# Altium project PulseAmplifier.PrjPcb
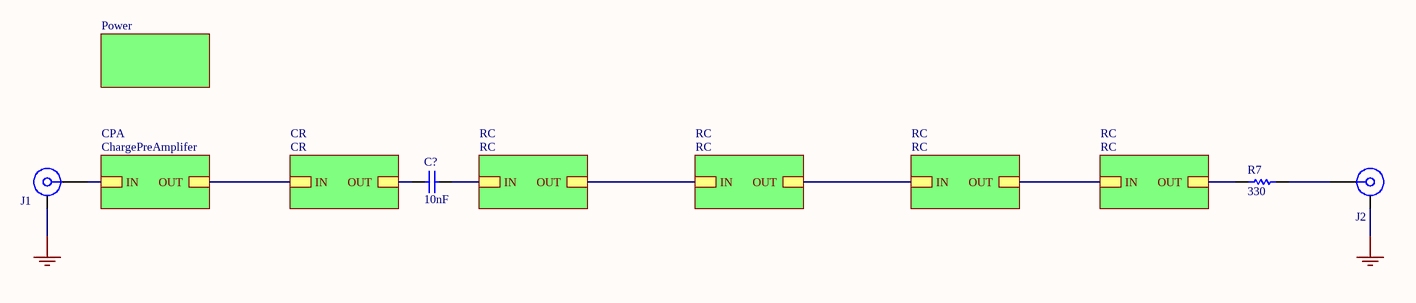
[diagram p0: pulseAmplifier.SchDoc]
5 sheets, 92 parts. Net scope: hierarchical (ports join the sheet entries above them; power ports are global).
Board file: PulseAmplifier.PcbDoc
Sheets:
  pulseAmplifier.SchDoc
     = Power.SchDoc
    CPA = ChargePreAmplifer.SchDoc
    CR = CR.SchDoc
    RC = RC.SchDoc
    RC = RC.SchDoc
    RC = RC.SchDoc
    RC = RC.SchDoc

## Sheet pulseAmplifier.SchDoc
size A4

### Parts
C?  10nF  [CAPC0603(1608)100_N]
J1  32K145-400L5  [ROS-32K145-400L5_V]  (value not drawn)
J2  32K145-400L5  [ROS-32K145-400L5_V]  (value not drawn)
R7  330  [RESC0603(1608)_N]

### Sub-sheets
CPA = ChargePreAmplifer: IN, OUT
CR = CR: IN, OUT
RC = RC: IN, OUT
RC = RC: IN, OUT
RC = RC: IN, OUT
RC = RC: IN, OUT
? = Power: no entries

### Nets
GND: J1.MP J2.MP
NetC8_2: sheet CPA/OUT, sheet CR/IN
NetC?_1: C?.1 ; sheet RC/IN
NetC?_2: C?.2 ; sheet CR/OUT
NetJ1_1: J1.1 ; sheet CPA/IN
NetJ2_1: J2.1 R7.2
NetR7_1: R7.1 ; sheet RC/OUT
NetR8_RC1_2: sheet RC/OUT, sheet RC/IN
NetR8_RC2_2: sheet RC/OUT, sheet RC/IN
NetR8_RC3_2: sheet RC/OUT, sheet RC/IN

### Library data of the parts
C? = CMP-1035-02589-1: 10nF Film; Value: 100nF; Case-EIA: 0603; Rated Voltage: 25 V; Tolerance: Â±20%; Case-Metric: 1608; Max Thickness: 1 mm; Technology: SMT
J1 J2 = CMP-0751-00004-2: SMA Right Angle Jack, Edge Mount, Up to 18 GHz, -55 to 155 degC; Manufacturer: Rosenberger; Desgin Note 2: For more information about DRC setting, please look at following webpage, http://techdocs.altium.com/display/SCRT/Design+Rule+for+Edge-Mount+Connectors; Design Note 1: Footprint in library is a generic example - only application specific footprint delivers High Performance; ComponentLink5Description: Webshop / RFQ; ComponentLink5URL: http://www.rosenberger.com/en/contact/sales/; ComponentLink3URL: http://rosenberger.de/ok/images/documents/db/32K145-400L5.pdf; DatasheetVersion: b00; ComponentLink2URL: http://rosenberger.de/ok/images/documents/db/32K145-400L5.pdf; ComponentLink4Description: Series Overview / Design Note; ComponentLink1Description: Manufacturer URL; PackageReference: 32K145-400L5; ComponentLink2Description: Datasheet; PartNumber: 32K145-400L5; PackageVersion: b00; PackageDescription: SMA Right Angle Jack, Edge Mount, 14.25 x 9.5 x 4.46 mm; ComponentLink3Description: Package Specification; ComponentLink1URL: http://www.rosenberger.de; ComponentLink4URL: http://rosenberger.de/ok/images/documents/spez/32.pdf; Mounting Technology: Surface Mount
R7 = CMP-1012-00397-1: 100R 0.1W 1% 0603 (1608 Metric)  SMD; Value: 100.00 Ohm; Case-EIA: 0603; Case-Metric: 1608; Technology: SMT; Tolerance: 1 %; Power: 0.1 W

## Sheet Power.SchDoc
size A4
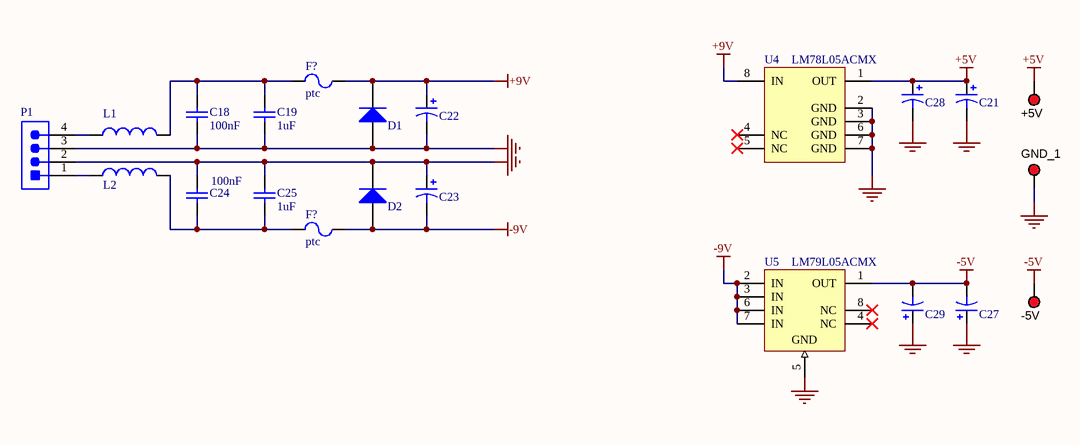
[diagram p1: Power.SchDoc]

### Parts
(Parts that share a designator on the sheet are numbered #1, #2 ... from top to bottom, then left to right.)
+5V  5010  [KSTN-5010_V]  (value not drawn)
-5V  5010  [KSTN-5010_V]  (value not drawn)
C18  100nF  [CAPC0603(1608)100_N]
C19  1uF  [CAPC0603(1608)100_N]
C21  ECA-1HM470  [PNSC-ECA-1HM470]  (value not drawn)
C22  ECA-1HM470  [PNSC-ECA-1HM470]  (value not drawn)
C23  ECA-1HM470  [PNSC-ECA-1HM470]  (value not drawn)
C24  100nF  [CAPC0603(1608)100_N]
C25  1uF  [CAPC0603(1608)100_N]
C27  ECA-1HM470  [PNSC-ECA-1HM470]  (value not drawn)
C28  ECA-1HM470  [PNSC-ECA-1HM470]  (value not drawn)
C29  ECA-1HM470  [PNSC-ECA-1HM470]  (value not drawn)
D1  MMSD4148T3G  [ONSC-SOD123-2-425G-04_V]  (value not drawn)
D2  MMSD4148T3G  [ONSC-SOD123-2-425G-04_V]  (value not drawn)
F?#1  ptc  [LFUS-1206L012WR_V]
F?#2  ptc  [LFUS-1206L012WR_V]
GND_1  5010  [KSTN-5010_V]  (value not drawn)
L1  FBMJ2125HM210NT  [INDC2013X105X50ML20T30]  (value not drawn)
L2  FBMJ2125HM210NT  [INDC2013X105X50ML20T30]  (value not drawn)
P1  22-27-2041  [MOLX-22-27-2041_V]  (value not drawn)
U4  LM78L05ACMX  [M08A_L]
U5  LM79L05ACMX  [D0008A_M]

### Nets
+5V: +5V.1 C21.1(+) C28.1(+) U4.1(OUT)
+9V: C22.1(+) D1.1(CATHODE) F?#1.2 U4.8(IN)
-5V: -5V.1 C27.2(-) C29.2(-) U5.1(OUT)
-9V: C23.2(-) D2.2(ANODE) F?#2.2 U5.2(IN) U5.3(IN) U5.6(IN) U5.7(IN)
GND: C18.1 C19.1 C21.2(-) C22.2(-) C23.1(+) C24.2 C25.2 C27.1(+) C28.2(-) C29.1(+) D1.2(ANODE) D2.1(CATHODE) GND_1.1 P1.2 P1.3 U4.2(GND) U4.3(GND) U4.6(GND) U4.7(GND) U5.5(GND)
NetC18_2: C18.2 C19.2 F?#1.1 L1.2
NetC24_1: C24.1 C25.1 F?#2.1 L2.2
NetL1_1: L1.1 P1.4
NetL2_1: L2.1 P1.1

Not connected (* = marked no-connect by the designer): U4 4(NC)* 5(NC)*; U5 4(NC)* 8(NC)*

### Library data of the parts
+5V -5V GND_1 = CMP-1672-00002-3: Test Point, Red, Through Hole, RoHS, Bulk; REACH SVHC: No SVHC; Contact Material: Bronze; PackageDescription: 1-Pin Through Hole Device, Dia 3.17 mm; Mounting Technology: Through Hole; Colour: Red; PackageReference: 5010; Height: 8.12 mm; Pins: 1; RoHSCompliant: true; Package Quantity: 100; Packaging: Bulk; Mount: Through Hole; DatasheetVersion: Rev. F, 12/2013; Contact Plating: Silver
C18 C24 = CMP-1035-02589-1: CAP 100nF 25V ±20% 0603 (1608 Metric) Thickness 1mm SMD; Case-EIA: 0603; Tolerance: Â±20%; Case-Metric: 1608; Value: 100nF; Max Thickness: 1 mm; Technology: SMT; Rated Voltage: 25 V
C19 C25 = CMP-1035-02589-1: CAP 1uF 25V ±20% 0603 (1608 Metric) Thickness 1mm SMD; Value: 100nF; Case-EIA: 0603; Tolerance: Â±20%; Case-Metric: 1608; Max Thickness: 1 mm; Technology: SMT; Rated Voltage: 25 V
C21-C23 C27-C29 = CMP-1665-00013-1: CAP ALUM 47UF 50V 20% RADIAL; PartNumber: ECA-1HM470; PackageReference: ECA-1HM470; ComponentLink1Description: Datasheet; ComponentLink1URL: http://industrial.panasonic.com/cdbs/www-data/pdf/RDF0000/ABA0000C1047.pdf
D1 D2 = CMP-0895-00002-1: Switching Diode, 100 V, 200 mA, -55 to 150 degC, 2-Pin SOD123 (425), RoHS, Tape and Reel; Manufacturer: ON Semiconductor; CD (Max): 4 pF; IR @ VR: 75 V (Max)=50 uA; PD (Max): 425 mW; VF (Max): 1 A; Trr (Max): 4 ns; VBR (Min): 100 V; ComponentLink1URL: http://www.onsemi.com/; ComponentLink1Description: Manufacturer URL; PackageReference: SOD123-2-425G-04; PackageDescription: 2-Pin SOD123, Body 2.69 x 1.6 mm, Height 1.35 mm; ComponentLink2Description: Datasheet; Mounting Technology: Surface Mount; RoHS: TRUE; PartNumber: MMSD4148T3G; PackageVersion: Rev. 04G; DatasheetVersion: Rev. 11; Temperature Range: -55 to 150 degC; ComponentLink3Description: Package Specification; Packing: Tape and Reel; ComponentLink3URL: http://www.onsemi.com/pub_link/Collateral/425-04.PDF; ComponentLink2URL: http://www.onsemi.com/pub_link/Collateral/MMSD4148T1-D.PDF
F?#1 F?#2 = CMP-2000-05470-1: 200mA PTC; Manufacturer: Littelfuse; Hold Current [Ih]: 0.125A; Working Voltage-Max: 30V; Trip Current: 0.29A; Operating Temp Range: -40to+85°C; Package Reference: 1206; Package Description: 2-Pin Surface Mount Device, Body 3.2 x 1.65 mm; Mounting Technology: SurfaceMount; Manufacturer URL: http://www.littelfuse.com/; Datasheet URL: https://datasheet.ciiva.com/26787/1206l012wr-26787215.pdf; Size: 1206; Datasheet Version: 04/2012
L1 L2 = CMP-1660-00003-1: Chip Inductor, 21 Ohm, +/- 30%, 6 A, -40 to 125 degC, 0805 (2012 Metric), RoHS, Tape and Reel; Core Material: Ferrite; Current Rating: 6 A; Resistance: 4 mohm; Case\Package: 0805; Impedance: 21 Ohm; Min Operating Temperature: -40 degC; Width: 1.25 mm; PackageDescription: 2-Pin Surface Mount Device, Body 2 x 1.25 mm; Mounting Technology: Surface Mount; Package Quantity: 1; DatasheetVersion: 08/2016; Tolerance: 30%; Mount: Surface Mount; Max Operating Temperature: 125 degC; Height: 0.85 mm; ComponentLink1URL: http://www.t-yuden.com/; Case Code (Metric): 2012; ComponentLink1Description: Manufacturer URL; ComponentLink2URL: http://ds.yuden.co.jp/TYCOMPAS/ut/detail.do?productNo=FBMJ2125HM210NT&fileName=FBMJ2125HM210NT_SS&mode=specSheetDownload; Case Code (Imperial): 0805; Packaging: Tape and Reel; ComponentLink2Description: Datasheet; PackageReference: 0805; RoHSCompliant: true; Max Current Rating: 6 A; Length: 2 mm; REACH SVHC: Unknown
P1 = CMP-2000-05243-1: Male Header, Pitch 2.54 mm, 1 x 4 Position, Height 11.7 mm, Tail Length 3.56 mm, RoHS, Bulk; Manufacturer: Molex; Voltage rating: 250V; Current rating: 4A; Datasheet Version: Rev. F, 06/2009; Operating temperature: 0degCto+75degC; Contact material: Tinplatedbrass; Manufacturer URL: http://www.molex.com/; Housing material: Nylon(UL94V-0); Datasheet URL: http://www.molex.com/pdm_docs/sd/022272041_sd.pdf
U4 = CMP-0062-01154-2: 3-Terminal Positive Regulators, 8-pin Narrow SOIC; Manufacturer: National Semiconductor; PackageTopMarking: NSZXTT*LM78L*05ACM; PowerWise: N; CompType: LDO IC; Code_JEDEC: MS-012-AA; PackageVersion: revM, May-2009; PackageDescription: SOIC Narrow, 4.9 x 3.9 x 1.45mm, 8 Lead, 1.27mm Pitch; ComponentLink2Description: LM78L05 Web Page; ComponentLink2URL: http://www.national.com/pf/LM/LM78L05.html; ComponentLink3Description: M08A Package Page; RevisionNote: Component URLs added; ComponentLink3URL: http://www.national.com/packaging/folders/m08a.html; ComponentLink1URL: http://www.national.com/ds/LM/LM78L05.pdf; ComponentLink1Description: LM78L05 Datasheet; PinCount: 8; DatasheetVersion: Apr-2006; Code_IPC: SOIC127P600-8; RoHS: N; PackageReference: M08A
U5 = CMP-0062-01120-3: Series 3-Terminal Negative Regulators, 8-pin Narrow SOIC; Manufacturer: Texas Instruments; CompType: LDO IC; PackageTopMarking: NSZXTT*LM79L*05ACM; PowerWise: N; PackageReference: D0008A; Code_JEDEC: MS-012-AA; PackageDescription: SOIC Narrow, 4.9 x 3.9 x 1.45mm, 8 Lead, 1.27mm Pitch; PinCount: 8; RoHS: N; Code_IPC: SOIC127P600-8; ComponentLink1Description: Datasheet URL; ComponentLink1URL: http://www.ti.com/general/docs/lit/getliterature.tsp?genericPartNumber=LM79L05&fileType=pdf

## Sheet ChargePreAmplifer.SchDoc
size A4
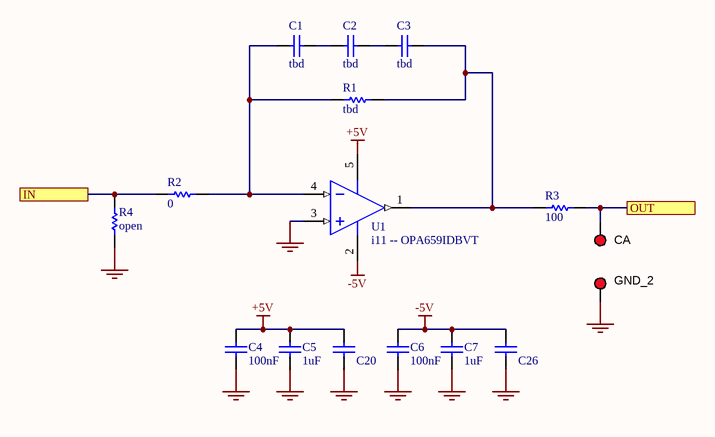
[diagram p2: ChargePreAmplifer.SchDoc]

### Parts
C1  tbd  [CAPC0603(1608)100_N]
C2  tbd  [CAPC0603(1608)100_N]
C3  tbd  [CAPC0603(1608)100_N]
C4  100nF  [CAPC0603(1608)100_N]
C5  1uF  [CAPC0603(1608)100_N]
C6  100nF  [CAPC0603(1608)100_N]
C7  1uF  [CAPC0603(1608)100_N]
C20  10uF X7R 10V 0805  [CAPC0805(2012)145_N]  (value not drawn)
C26  10uF X7R 10V 0805  [CAPC0805(2012)145_N]  (value not drawn)
CA  5010  [KSTN-5010_V]  (value not drawn)
GND_2  5010  [KSTN-5010_V]  (value not drawn)
R1  tbd  [RESC0603(1608)_N]
R2  0  [RESC0603(1608)_N]
R3  100  [RESC0603(1608)_L]
R4  open  [RESC0603(1608)_N]
U1  i11 -- OPA659IDBVT  [TI-DBV5_L]

### Ports
IN, OUT

### Nets
+5V: C4.2 C5.2 C20.2 U1.5(VS+)
-5V: C6.2 C7.2 C26.2 U1.2(VS-)
GND: C4.1 C5.1 C6.1 C7.1 C20.1 C26.1 GND_2.1 R4.1 U1.3(IN+)
NetC1_1: C1.1 C2.2
NetC1_2: C1.2 R1.1 R2.2 U1.4(IN-)
NetC2_1: C2.1 C3.2
NetC3_1: C3.1 R1.2 R3.1 U1.1(OUT)
NetC8_2: CA.1 R3.2 ; port OUT
NetJ1_1: R2.1 R4.2 ; port IN

### Library data of the parts
C1-C3 C5 C7 = CMP-1035-02589-1: as C19 on sheet Power; Max Thickness: 1 mm; Technology: SMT; Rated Voltage: 25 V
C4 C6 = CMP-1035-02589-1: as C18 on sheet Power; Value: 100nF; Max Thickness: 1 mm; Technology: SMT; Rated Voltage: 25 V
C20 C26 = CMP-1036-04932-1: Case-EIA: 0805; Case-Metric: 2012; Rated Voltage: 25 V; Tolerance: Â±10%; Technology: SMT; Value: 10uF; Max Thickness: 1.45 mm
CA GND_2 = CMP-1672-00002-3: as +5V on sheet Power; REACH SVHC: No SVHC; Contact Material: Bronze; PackageDescription: 1-Pin Through Hole Device, Dia 3.17 mm; Mounting Technology: Through Hole; Colour: Red; PackageReference: 5010; Height: 8.12 mm; Pins: 1; RoHSCompliant: true; Package Quantity: 100; Packaging: Bulk; Mount: Through Hole; DatasheetVersion: Rev. F, 12/2013; Contact Plating: Silver
R1-R4 = CMP-1012-00397-1: as R7 on sheet pulseAmplifier; Technology: SMT; Tolerance: 1 %; Power: 0.1 W
U1 = CMP-0018-00409-1: 650 MHz Unity Gain Stable JFET Input Amplifier, 7 to 13 V, -40 to 85 degC, 5-pin SOT23 (DBV5), Green (RoHS & no Sb/Br); Manufacturer: Texas Instruments; Number of Channels: 1; THD (Fc is 1 MHz)(Typ)(dB): -78; BW @ Acl(MHz): 650; Slew Rate(Typ)(V/us): 2550; Vs(Max)(V): 13; 3rd Harmonic(dBc): 100; Sub Family: High Output Current Amplifier (>=50mA), High Speed Amplifier (>=50MHz); Vn at Flatband(Typ)(nV/rtHz): 8.9; 2nd Harmonic(dBc): 79; Vio(Max)(mV): 5; Vs(Min)(V): 7; Acl, min stable gain(V/V): 2; Io(Typ)(mA): 70; @ MHz: 10; Iq per channel(Max)(mA): 33.5; Iib(Max)(nA): 1.2; Code_JEDEC: MO-178; ComponentLink1Description: Manufacturer URL; ComponentLink3Description: Package Specification; PackageReference: DBV5; PackageVersion: 4073253-4/K, 03/2006; ComponentLink3URL: http://www.ti.com/litv/pdf/mpds018i; ComponentLink2Description: Datasheet; Mounting Technology: Surface Mount; PackageDescription: 5-Pin Plastic Small Outline, Body 1.6 x 2.9 mm, Pitch 0.95 mm; PartNumber: OPA659IDBVT; DatasheetVersion: SBOS342B; ComponentLink1URL: http://www.ti.com/; Eco-Plan: Green (RoHS & no Sb/Br); ComponentLink2URL: http://www.ti.com/general/docs/lit/getliterature.tsp?genericPartNumber=OPA659&fileType=pdf

## Sheet CR.SchDoc
size A4
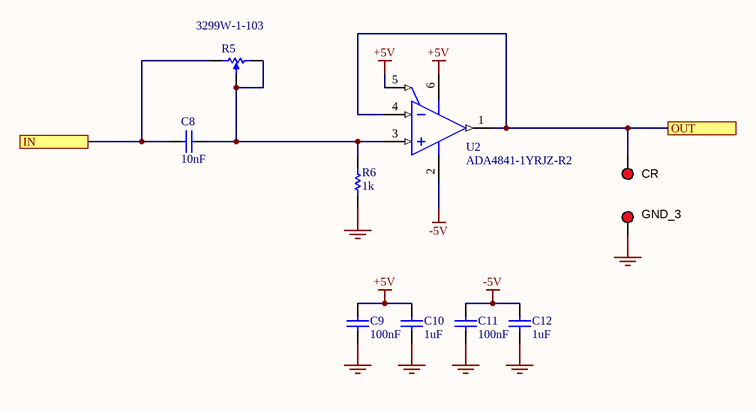
[diagram p3: CR.SchDoc]

### Parts
C8  10nF  [CAPC0603(1608)100_N]
C9  100nF  [CAPC0603(1608)100_N]
C10  1uF  [CAPC0603(1608)100_N]
C11  100nF  [CAPC0603(1608)100_N]
C12  1uF  [CAPC0603(1608)100_N]
CR  5010  [KSTN-5010_V]  (value not drawn)
GND_3  5010  [KSTN-5010_V]  (value not drawn)
R5  3299W-1-103  [BOUR-3299W-3_V]
R6  1k  [RESC0603(1608)_N]
U2  ADA4841-1YRJZ-R2  [ADI-RJ-6_M]

### Ports
IN, OUT

### Nets
+5V: C9.2 C10.2 U2.5(~{POWER_DOWN}) U2.6(+VS)
-5V: C11.2 C12.2 U2.2(-VS)
GND: C9.1 C10.1 C11.1 C12.1 GND_3.1 R6.1
NetC8_1: C8.1 R5.2 R5.3 R6.2 U2.3(+IN)
NetC8_2: C8.2 R5.1 ; port IN
NetC?_2: CR.1 U2.1(VOUT) U2.4(-IN) ; port OUT

### Library data of the parts
C8 = CMP-1035-02589-1: as C? on sheet pulseAmplifier; Max Thickness: 1 mm; Technology: SMT
C9 C11 = CMP-1035-02589-1: as C18 on sheet Power; Value: 100nF; Max Thickness: 1 mm; Technology: SMT; Rated Voltage: 25 V
C10 C12 = CMP-1035-02589-1: as C19 on sheet Power; Max Thickness: 1 mm; Technology: SMT; Rated Voltage: 25 V
CR GND_3 = CMP-1672-00002-3: as +5V on sheet Power; REACH SVHC: No SVHC; Contact Material: Bronze; PackageDescription: 1-Pin Through Hole Device, Dia 3.17 mm; Mounting Technology: Through Hole; Colour: Red; PackageReference: 5010; Height: 8.12 mm; Pins: 1; RoHSCompliant: true; Package Quantity: 100; Packaging: Bulk; Mount: Through Hole; DatasheetVersion: Rev. F, 12/2013; Contact Plating: Silver
R5 = CMP-2000-05584-1: Square Trimpot(R) Trimming Potentiometer, 10 KOhm, +/- 10%, 500 mW, -55 to 125 degC, 3-Pin THD, RoHS, Tube; Element Type: Cermet; Unit Weight: 0.035000oz; Brand: Bourns; Power Rating: 500mW(1/2W); Resistance: 10kOhms; Qualification: Commercial; Adjustment: TopCrossed; Datasheet Version: 04/2014; Product Category: TrimmerResistors-ThroughHole; Mounting Technology: ThroughHole; Manufacturer URL: http://www.bourns.com/; Package Description: 3-Pin Surface Mount Device, Body 9.53 x 6.1 mm, Pitch 2.54 mm; Product: Multiturn; Length: 10.03mm; Termination Style: Pin; Tradename: Trimpot; Type: Trimmers; Manufacturer: Bourns; Width: 9.53mm; Mounting: PanelMount; RoHS: No / RoHSVersionAvailable; Taper: Linear; Datasheet URL: http://www.bourns.com/docs/Product-Datasheets/3299.pdf; Product Type: SquareTrimmingPotentiometer; Package Reference: 3299W; Tolerance: 10%; Series: 3299; Operating Temperature Range: -55Cto+125C; Packaging: Tube
R6 = CMP-1012-00397-1: 1k 1% Metal film; Value: 100.00 Ohm; Case-EIA: 0603; Power: 0.1 W; Case-Metric: 1608; Technology: SMT; Tolerance: 1 %
U2 = CMP-0384-01553-2: Single Channel Low Wide Band Noise Operational Amplifier, 80 MHz BW, 13 V/us SR, Industrial, 6-pin SOT23 (RJ-6), Reel; Manufacturer: Analog Devices; Slew Rate: 13V/us; Small Signal Bandwidth: 80MHz; Input Offset Voltage: 40uV; V Span Min: 2.7V; Iq/Amp: 1.5mA; V Span Max: 12V; Amplifiers Per Package: 1; Input Bias Current: 3uA; ComponentLink2URL: http://www.analog.com/static/imported-files/data_sheets/ADA4841-1_4841-2.pdf; Code_JEDEC: MO-178-AB; PartNumber: ADA4841-1YRJZ-R2; ComponentLink1URL: http://www.analog.com/en/index.html; ComponentLink2Description: Datasheet; ComponentLink3Description: Package Specification; ComponentLink4Description: Reference Circuit; Mounting Technology: Surface Mount; RevisionNote: Reference Circuit URL fixed; PackageReference: RJ-6; ComponentLink4URL: http://www.analog.com/en/all-operational-amplifiers-op-amps/operational-amplifiers-op-amps/ada4841-1/products/product.html#product-recommendations; PackageDescription: 6-Pin Small Outline Transistor Package, Body 2.9 x 1.6 mm, Pitch 0.95 mm; ComponentLink1Description: Manufacturer URL; DatasheetVersion: Rev. E; PackageVersion: 121608-A; ComponentLink3URL: http://www.analog.com/static/imported-files/packages/PKG_PDF/SOT-23(RJ)/RJ_6.pdf; Generic Part Number: ADA4841-1

## Sheet RC.SchDoc
size A4
Used 4 times, as channels RC, RC, RC, RC. Parts and nets are listed once, with the designators drawn on the sheet.
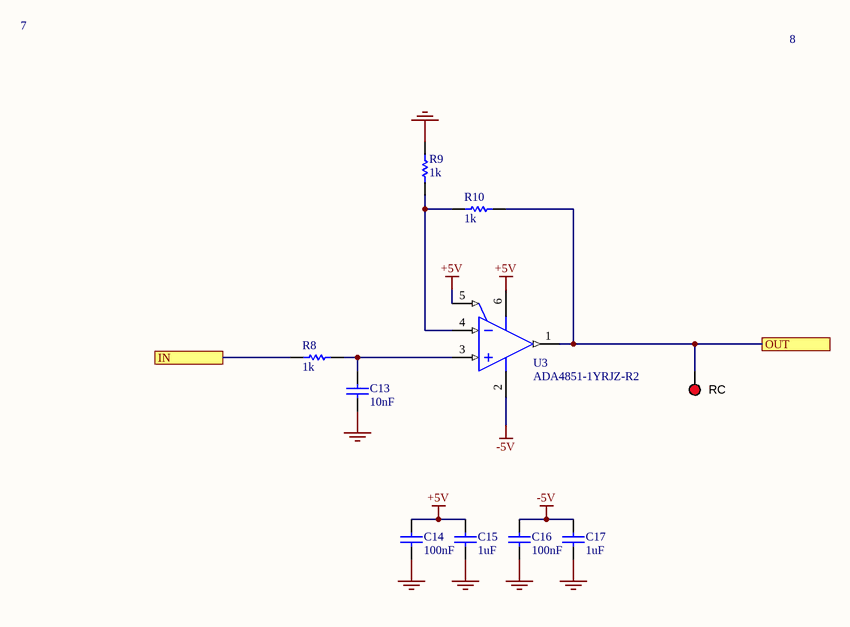
[diagram p4: RC.SchDoc]

### Parts
C13  10nF  [CAPC0603(1608)100_N]
C14  100nF  [CAPC0603(1608)100_N]
C15  1uF  [CAPC0603(1608)100_N]
C16  100nF  [CAPC0603(1608)100_N]
C17  1uF  [CAPC0603(1608)100_N]
R8  1k  [RESC0603(1608)_N]
R9  1k  [RESC0603(1608)_N]
R10  1k  [RESC0603(1608)_N]
RC  5010  [KSTN-5010_V]  (value not drawn)
U3  ADA4851-1YRJZ-R2  [ADI-RJ-6_N]

### Ports
IN, OUT

### Nets
+5V: C14.2 C15.2 U3.5(~{POWER_DOWN}) U3.6(+VS)
-5V: C16.2 C17.2 U3.2(-VS)
GND: C13.2 C14.1 C15.1 C16.1 C17.1 R9.1
IN: R8.2 ; port IN
OUT: R10.1 RC.1 U3.1(VOUT) ; port OUT
NetC13_1: C13.1 R8.1 U3.3(+IN)
NetR9_2: R9.2 R10.2 U3.4(-IN)

### Channels
RC: designators end in _RC4; ports IN=NetC?_1 OUT=NetR8_RC3_2
RC: designators end in _RC3; ports IN=NetR8_RC3_2 OUT=NetR8_RC2_2
RC: designators end in _RC2; ports IN=NetR8_RC2_2 OUT=NetR8_RC1_2
RC: designators end in _RC1; ports IN=NetR8_RC1_2 OUT=NetR7_1

### Notes on the sheet
- 7
- 8

### Library data of the parts
C13 = CMP-1035-02589-1: as C? on sheet pulseAmplifier; Max Thickness: 1 mm; Technology: SMT
C14 C16 = CMP-1035-02589-1: as C18 on sheet Power; Value: 100nF; Max Thickness: 1 mm; Technology: SMT; Rated Voltage: 25 V
C15 C17 = CMP-1035-02589-1: as C19 on sheet Power; Max Thickness: 1 mm; Technology: SMT; Rated Voltage: 25 V
R8-R10 = CMP-1012-00397-1: as R6 on sheet CR; Technology: SMT; Tolerance: 1 %
RC = CMP-1672-00002-3: as +5V on sheet Power; REACH SVHC: No SVHC; Contact Material: Bronze; PackageDescription: 1-Pin Through Hole Device, Dia 3.17 mm; Mounting Technology: Through Hole; Colour: Red; PackageReference: 5010; Height: 8.12 mm; Pins: 1; RoHSCompliant: true; Package Quantity: 100; Packaging: Bulk; Mount: Through Hole; DatasheetVersion: Rev. F, 12/2013; Contact Plating: Silver
U3 = CMP-0384-01563-2: Single Channel Low Power Operational Amplifier, 130 MHz BW, 375 V/us SR, Industrial, 6-pin SOT23 (RJ-6), Reel; Manufacturer: Analog Devices; V Span Max: 12V; Amplifiers Per Package: 1; Iq/Amp: 3.2mA; Small Signal Bandwidth: 130MHz; Automotive Qualified: Yes; Input Offset Voltage: 600uV; Input Bias Current: 2.2uA; V Span Min: 2.7V; DatasheetVersion: Rev. J; PartNumber: ADA4851-1YRJZ-R2; ComponentLink2Description: Datasheet; ComponentLink1URL: http://www.analog.com/en/index.html; ComponentLink3URL: http://www.analog.com/static/imported-files/packages/PKG_PDF/SOT-23(RJ)/RJ_6.pdf; ComponentLink3Description: Package Specification; ComponentLink1Description: Manufacturer URL; Mounting Technology: Surface Mount; Code_JEDEC: MO-178-AB; Generic Part Number: ADA4851-1; PackageReference: RJ-6; RevisionNote: Reference Circuit URL fixed; ComponentLink4URL: http://www.analog.com/en/all-operational-amplifiers-op-amps/operational-amplifiers-op-amps/ada4851-1/products/product.html#product-recommendations; Slew Rate: 375V/us; ComponentLink4Description: Reference Circuit; ComponentLink2URL: http://www.analog.com/static/imported-files/data_sheets/ADA4851-1_4851-2_4851-4.pdf; PackageDescription: 6-Pin Small Outline Transistor Package, Body 2.9 x 1.6 mm, Pitch 0.95 mm; PackageVersion: 121608-A

## Nets that join several sheets
+5V: Power (+5V.1 C21.1 C28.1 U4.1), ChargePreAmplifer (C4.2 C5.2 C20.2 U1.5), CR (C9.2 C10.2 U2.5 U2.6), RC (C14_RC4.2 C15_RC4.2 U3_RC4.5 U3_RC4.6), RC (C14_RC3.2 C15_RC3.2 U3_RC3.5 U3_RC3.6), RC (C14_RC2.2 C15_RC2.2 U3_RC2.5 U3_RC2.6), RC (C14_RC1.2 C15_RC1.2 U3_RC1.5 U3_RC1.6)
-5V: Power (-5V.1 C27.2 C29.2 U5.1), ChargePreAmplifer (C6.2 C7.2 C26.2 U1.2), CR (C11.2 C12.2 U2.2), RC (C16_RC4.2 C17_RC4.2 U3_RC4.2), RC (C16_RC3.2 C17_RC3.2 U3_RC3.2), RC (C16_RC2.2 C17_RC2.2 U3_RC2.2), RC (C16_RC1.2 C17_RC1.2 U3_RC1.2)
GND: pulseAmplifier (J1.MP J2.MP), Power (20 pins), ChargePreAmplifer (9 pins), CR (6 pins), RC (6 pins), RC (6 pins), RC (6 pins), RC (6 pins)
NetC8_2: ChargePreAmplifer (CA.1 R3.2), CR (C8.2 R5.1)
NetC?_1: pulseAmplifier (C?.1), RC (R8_RC4.2)
NetC?_2: pulseAmplifier (C?.2), CR (CR.1 U2.1 U2.4)
NetJ1_1: pulseAmplifier (J1.1), ChargePreAmplifer (R2.1 R4.2)
NetR7_1: pulseAmplifier (R7.1), RC (R10_RC1.1 RC_RC1.1 U3_RC1.1)
NetR8_RC1_2: RC (R10_RC2.1 RC_RC2.1 U3_RC2.1), RC (R8_RC1.2)
NetR8_RC2_2: RC (R10_RC3.1 RC_RC3.1 U3_RC3.1), RC (R8_RC2.2)
NetR8_RC3_2: RC (R10_RC4.1 RC_RC4.1 U3_RC4.1), RC (R8_RC3.2)